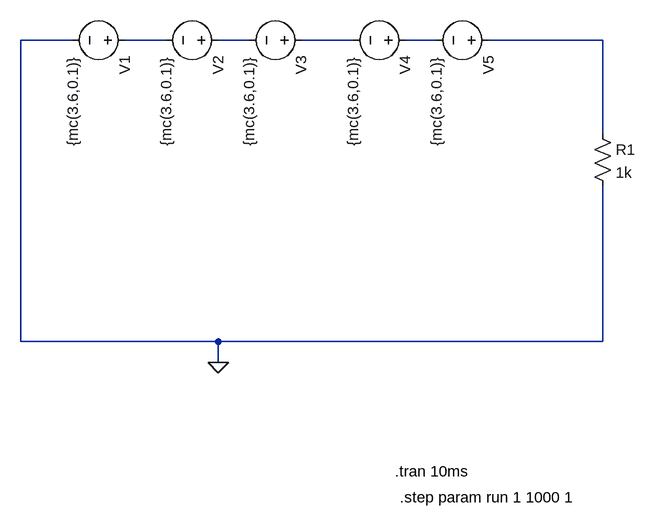
[diagram p0: schematic batterysim.asc]
batterysim.asc, the LTspice schematic file:
Version 4
SHEET 1 1612 828
WIRE 704 -64 624 -64
WIRE 848 -64 784 -64
WIRE 976 -64 928 -64
WIRE 1136 -64 1056 -64
WIRE 1264 -64 1216 -64
WIRE 1520 -64 1344 -64
WIRE 1520 80 1520 -64
WIRE 624 400 624 -64
WIRE 928 400 624 400
WIRE 1520 400 1520 160
WIRE 1520 400 928 400
WIRE 928 432 928 400
FLAG 928 432 0
SYMBOL voltage 800 -64 R90
WINDOW 123 0 0 Left 0
WINDOW 39 24 124 Left 2
SYMATTR InstName V1
SYMATTR Value {mc(3.6,0.1)}
SYMBOL voltage 944 -64 R90
WINDOW 123 0 0 Left 0
WINDOW 39 24 124 Left 2
SYMATTR InstName V2
SYMATTR Value {mc(3.6,0.1)}
SYMBOL voltage 1072 -64 R90
WINDOW 123 0 0 Left 0
WINDOW 39 24 124 Left 2
SYMATTR InstName V3
SYMATTR Value {mc(3.6,0.1)}
SYMBOL voltage 1232 -64 R90
WINDOW 123 0 0 Left 0
WINDOW 39 24 124 Left 2
SYMATTR InstName V4
SYMATTR Value {mc(3.6,0.1)}
SYMBOL voltage 1360 -64 R90
WINDOW 123 0 0 Left 0
WINDOW 39 24 124 Left 2
SYMATTR InstName V5
SYMATTR Value {mc(3.6,0.1)}
SYMBOL res 1504 64 R0
SYMATTR InstName R1
SYMATTR Value 1k
TEXT 1200 600 Left 2 !.tran 10ms
TEXT 1208 640 Left 2 !.step param run 1 1000 1

The netlist it stands for:
* batterysim.asc
V1 N001 0 {mc(3.6,0.1)}
V2 N002 N001 {mc(3.6,0.1)}
V3 N003 N002 {mc(3.6,0.1)}
V4 N004 N003 {mc(3.6,0.1)}
V5 N005 N004 {mc(3.6,0.1)}
R1 N005 0 1k
.tran 10ms
.step param run 1 1000 1
.backanno
.end